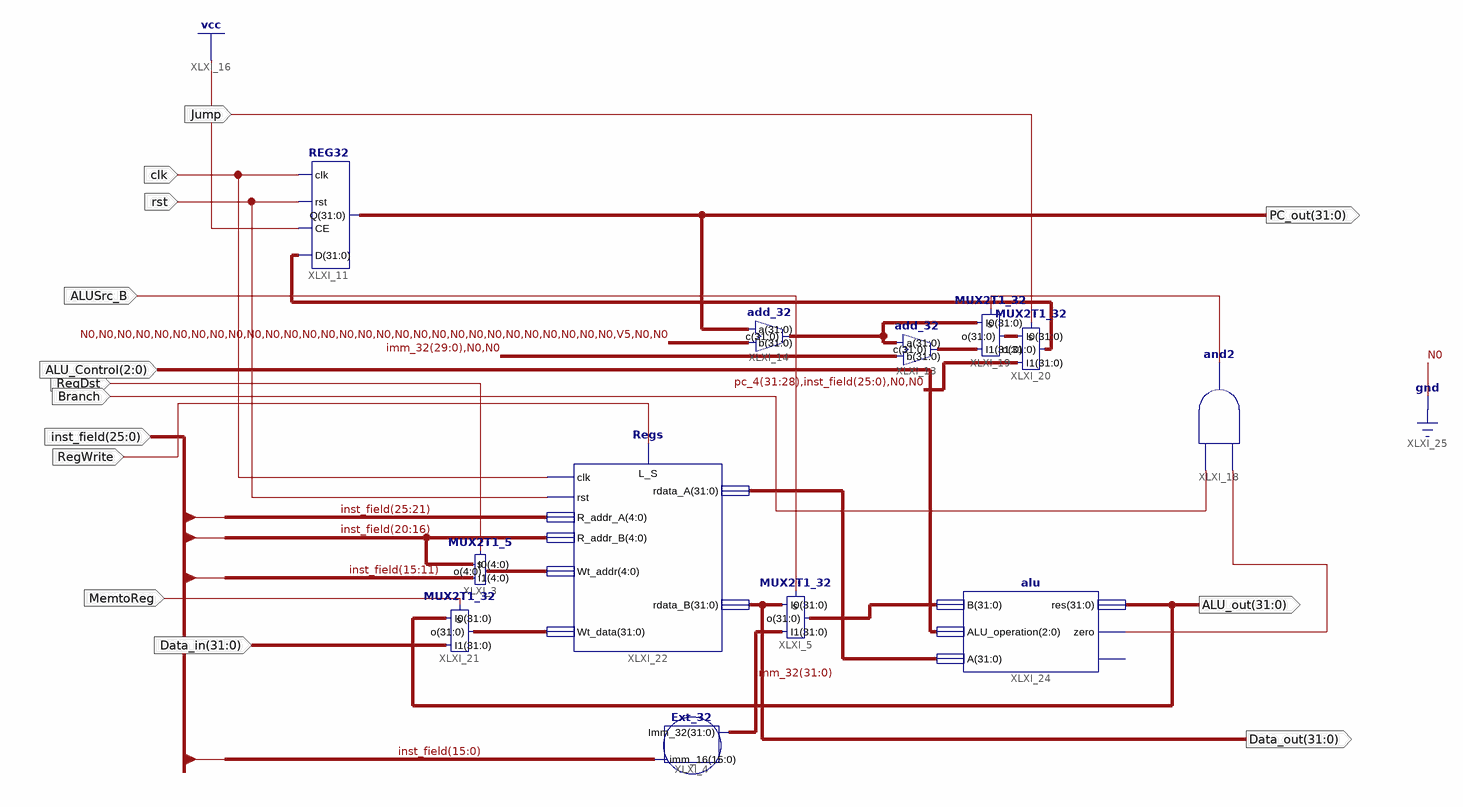
[diagram p0: schematic sheet 1]
// Xilinx ISE schematic Data_path.sch (kintex7) as structural Verilog: 12 symbols, 14 ports
module Data_path (
  input  clk,
  input  rst,
  input  [25:0] inst_field,
  input  RegDst,
  input  [31:0] Data_in,
  input  [2:0] ALU_Control,
  input  ALUSrc_B,
  input  Jump,
  input  Branch,
  input  RegWrite,
  input  MemtoReg,
  output [31:0] PC_out,
  output [31:0] ALU_out,
  output [31:0] Data_out
);

  wire XLXN_57, zero;
  wire [4:0] XLXN_27;
  wire [31:0] imm_32, pc_4, XLXN_7, XLXN_28, XLXN_41, XLXN_50, XLXN_58, XLXN_61;

  MUX2T1_5 XLXI_3 (.I1(inst_field[15:11]), .I0(inst_field[20:16]), .o(XLXN_27), .s(RegDst));
  Ext_32 XLXI_4 (.imm_16(inst_field[15:0]), .Imm_32(imm_32));
  MUX2T1_32 XLXI_5 (.s(ALUSrc_B), .I0(Data_out), .I1(imm_32), .o(XLXN_41));
  REG32 XLXI_11 (.D(XLXN_7), .CE(1'b1), .rst(rst), .clk(clk), .Q(PC_out));
  add_32 XLXI_13 (.c(XLXN_50), .a(pc_4), .b({imm_32[29:0], 2'b00}));
  add_32 XLXI_14 (.c(pc_4), .a(PC_out), .b(32'b00000000000000000000000000000100));
  and XLXI_18 (XLXN_57, zero, Branch);
  MUX2T1_32 XLXI_19 (.s(XLXN_57), .I0(pc_4), .I1(XLXN_50), .o(XLXN_58));
  MUX2T1_32 XLXI_20 (.s(Jump), .I0(XLXN_58), .I1({pc_4[31:28], inst_field, 2'b00}), .o(XLXN_7));
  MUX2T1_32 XLXI_21 (.s(MemtoReg), .I0(ALU_out), .I1(Data_in), .o(XLXN_28));
  Regs XLXI_22 (
    .clk(clk), .L_S(RegWrite), .rdata_A(XLXN_61), .rst(rst), .Wt_data(XLXN_28), .rdata_B(Data_out),
    .R_addr_A(inst_field[25:21]), .R_addr_B(inst_field[20:16]), .Wt_addr(XLXN_27));
  alu XLXI_24 (.B(XLXN_41), .ALU_operation(ALU_Control), .A(XLXN_61), .res(ALU_out), .zero(zero));  // open: overflow
endmodule
